# EAGLE design shield (EAGLE 6.4)
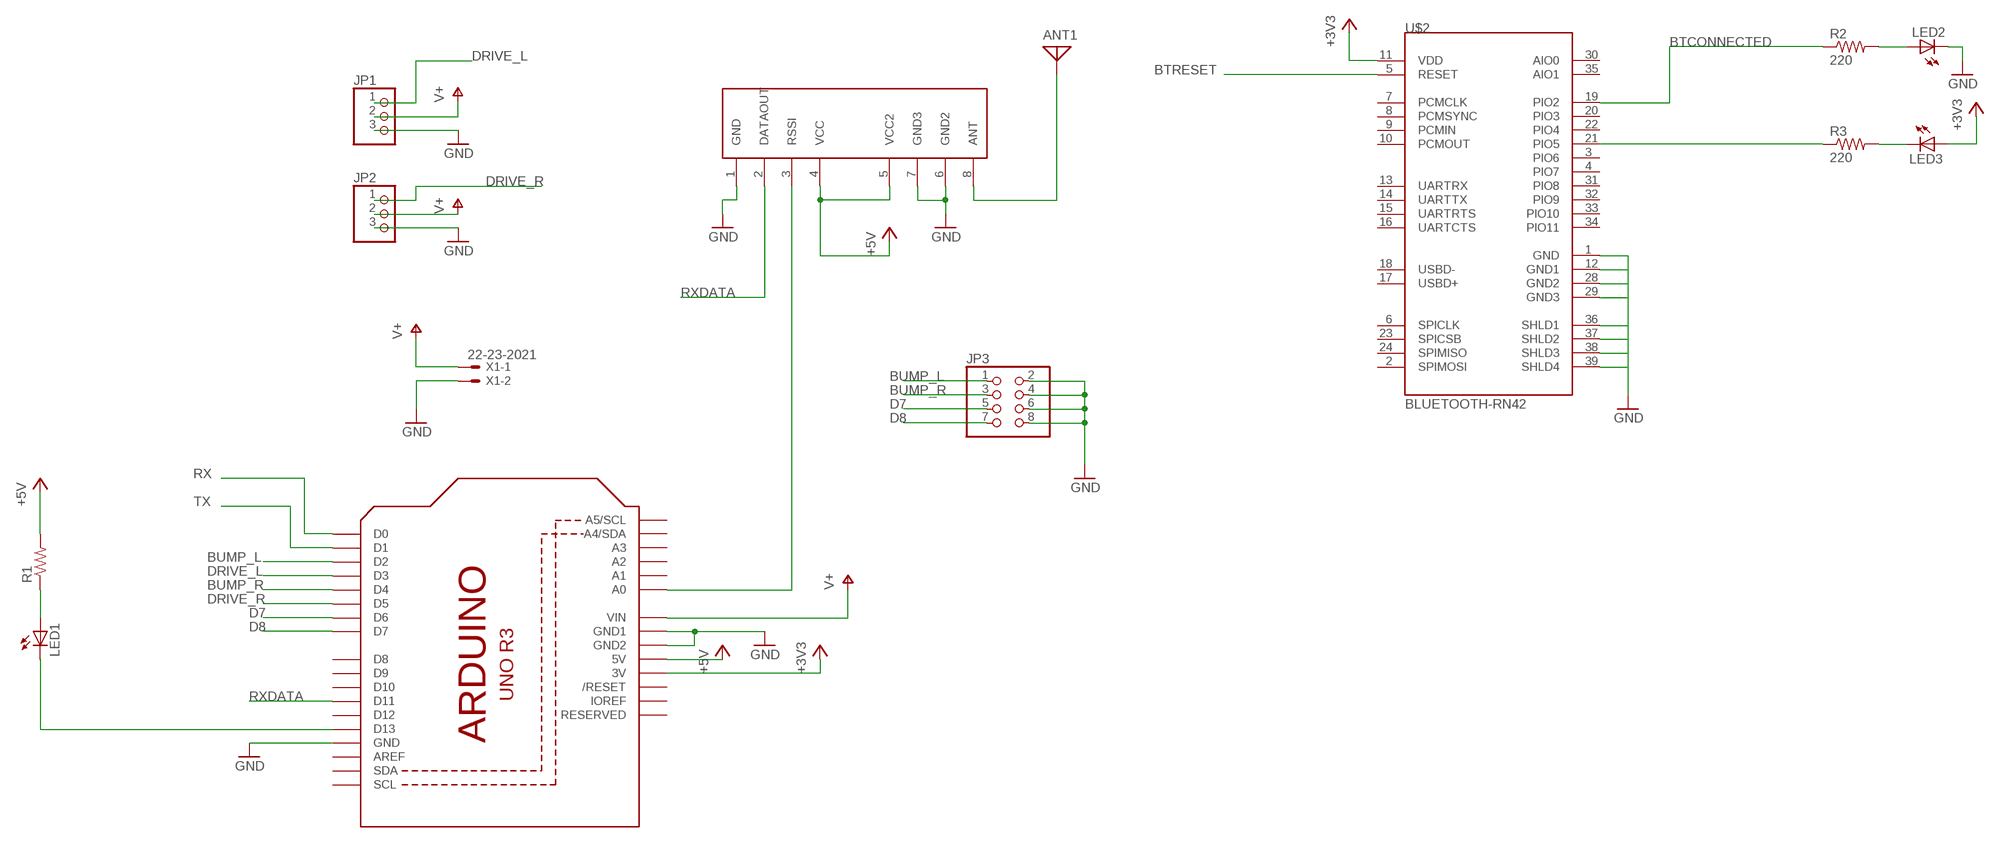
[diagram p0: schematic, sheet 1]

## Parts
ANT1  ANTENNA  [PAD-01]
JP1  PINHD-1X3  [1X03]
JP2  PINHD-1X3  [1X03]
JP3  PINHD-2X4  [2X04]
LED1  LED3MM  [LED3MM]
LED2  LED3MM  [LED3MM]
LED3  LED3MM  [LED3MM]
R1  R-US_R0805  [R0805]
R2  220  R-US_R0805  [R0805]
R3  220  R-US_R0805  [R0805]
U1  ARDUINOR3-DIMENSION  [ARDUINOR3]
U$1  RWS371  [RWS-371]
U$2  BLUETOOTH-RN42  [RN42]
X1  22-23-2021  [22-23-2021]

## Nets
+3V3: LED3.A U1.3V U$2.11(VDD)
+5V: R1.2 U1.5V U$1.4(VCC) U$1.5(VCC2)
BTCONNECTED: R2.1 U$2.19(PIO2)
BTRESET: U$2.5(RESET)
BUMP_L: JP3.1 U1.D2
BUMP_R: JP3.3 U1.D4
D7: JP3.5 U1.D6
D8: JP3.7 U1.D7
DRIVE_L: JP1.1 U1.D3
DRIVE_R: JP2.1 U1.D5
GND: JP1.3 JP2.3 JP3.2 JP3.4 JP3.6 JP3.8 LED2.K(C) U1.GND U1.GND1 U1.GND2 U$1.1(GND) U$1.6(GND2) U$1.7(GND3) U$2.1(GND) U$2.12(GND1) U$2.28(GND2) U$2.29(GND3) U$2.36(SHLD1) U$2.37(SHLD2) U$2.38(SHLD3) U$2.39(SHLD4) X1.2
N$1: U1.A0 U$1.3(RSSI)
N$2: LED1.A R1.1
N$3: LED1.K(C) U1.D13
N$4: ANT1.1 U$1.8(ANT)
N$5: LED2.A R2.2
N$7: LED3.K(C) R3.2
N$8: R3.1 U$2.21(PIO5)
RX: U1.D0
RXDATA: U1.D11 U$1.2(DATAOUT)
TX: U1.D1
V+: JP1.2 JP2.2 U1.VIN X1.1
Unconnected: U1.A1 U1.A2 U1.A3 U1.A4(A4/SDA) U1.A5(A5/SCL) U1.AREF U1.D8 U1.D9 U1.D10 U1.D12 U1.IOREF U1.RESERVED U1.RESET(/RESET) U1.SCL U1.SDA U$2.2(SPIMOSI) U$2.3(PIO6) U$2.4(PIO7) U$2.6(SPICLK) U$2.7(PCMCLK) U$2.8(PCMSYNC) U$2.9(PCMIN) U$2.10(PCMOUT) U$2.13(UARTRX) U$2.14(UARTTX) U$2.15(UARTRTS) U$2.16(UARTCTS) U$2.17(USBD+) U$2.18(USBD-) U$2.20(PIO3) U$2.22(PIO4) U$2.23(SPICSB) U$2.24(SPIMISO) U$2.30(AIO0) U$2.31(PIO8) U$2.32(PIO9) U$2.33(PIO10) U$2.34(PIO11) U$2.35(AIO1)

## Library data of the parts
ANT1 = discrete:ANTENNA: Antenna
JP1 JP2 = adafruit:PINHD-1X3: PIN HEADER
JP3 = adafruit:PINHD-2X4: PIN HEADER
LED1-LED3 = led:LED: LED OSRAM: - CHIPLED LG R971, LG N971, LY N971, LG Q971, LY Q971, LO R971, LY R971 LH N974, LH R974 LS Q976, LO Q976, LY Q976 LO Q996 - Hyper CHIPLED LW Q18S LB Q993, LB Q99A, LB R99A - SideLED LS A670, LO A670, LY A670, LG A670, LP A670 LB A673, LV A673, LT A673, LW A673 LH A674 LY A675 LS A676, LA A676, LO A676, LY A676, LW A676 LS A679, LY A679, LG A679 - Hyper Micro SIDELED® LS Y876, LA Y876, LO Y876, LY Y876 LT Y87S - SmartLED LW L88C, LW L88S LB L89C, LB L89S, LG L890 LS L89K, LO L89K, LY L89K LS L896, LA L896, LO L896, LY L896 - TOPLED LS T670, LO T670, LY T670, LG T670, LP T670 LSG T670, LSP T670, LSY T670, LOP T670, LYG T670 LG T671, LOG T671, LSG T671 LB T673, LV T673, LT T673, LW T673 LH T674 LS T676, LA T676, LO T676, LY T676, LB T676, LH T676, LSB T676, LW T676 LB T67C, LV T67C, LT T67C, LS T67K, LO T67K, LY T67K, LW E67C LS E67B, LA E67B, LO E67B, LY E67B, LB E67C, LV E67C, LT E67C LW T67C LS T679, LY T679, LG T679 LS T770, LO T770, LY T770, LG T770, LP T770 LB T773, LV T773, LT T773, LW T773 LH T774 LS E675, LA E675, LY E675, LS T675 LS T776, LA T776, LO T776, LY T776, LB T776 LHGB T686 LT T68C, LB T68C - Hyper Mini TOPLED® LB M676 - Mini TOPLED Santana® LG M470 LS M47K, LO M47K, LY M47K Source: http://www.osram.convergy.de LUXEON: - LUMILED® LXK2-PW12-R00, LXK2-PW12-S00, LXK2-PW14-U00, LXK2-PW14-V00 LXK2-PM12-R00, LXK2-PM12-S00, LXK2-PM14-U00 LXK2-PE12-Q00, LXK2-PE12-R00, LXK2-PE12-S00, LXK2-PE14-T00, LXK2-PE14-U00 LXK2-PB12-K00, LXK2-PB12-L00, LXK2-PB12-M00, LXK2-PB14-N00, LXK2-PB14-P00, LXK2-PB14-Q00 LXK2-PR12-L00, LXK2-PR12-M00, LXK2-PR14-Q00, LXK2-PR14-R00 LXK2-PD12-Q00, LXK2-PD12-R00, LXK2-PD12-S00 LXK2-PH12-R00, LXK2-PH12-S00 LXK2-PL12-P00, LXK2-PL12-Q00, LXK2-PL12-R00 Source: www.luxeon.com KINGBRIGHT: KA-3528ASYC Source: www.kingbright.com
R1-R3 = resistor:R-US_: RESISTOR, American symbol
U1 = adafruit:ARDUINOR3: This is a new object for the new Arduino R3 - with extra pins that you may want to use (such as IOref, and duplicated A4/A5
U$1 = rkf:RWS371
U$2 = RN4x:BLUETOOTH-RN42
X1 = con-molex:22-23-2021: .100" (2.54mm) Center Header - 2 Pin; MF: MOLEX; MPN: 22-23-2021; OC_FARNELL: 1462926; OC_NEWARK: 25C3832

## Board
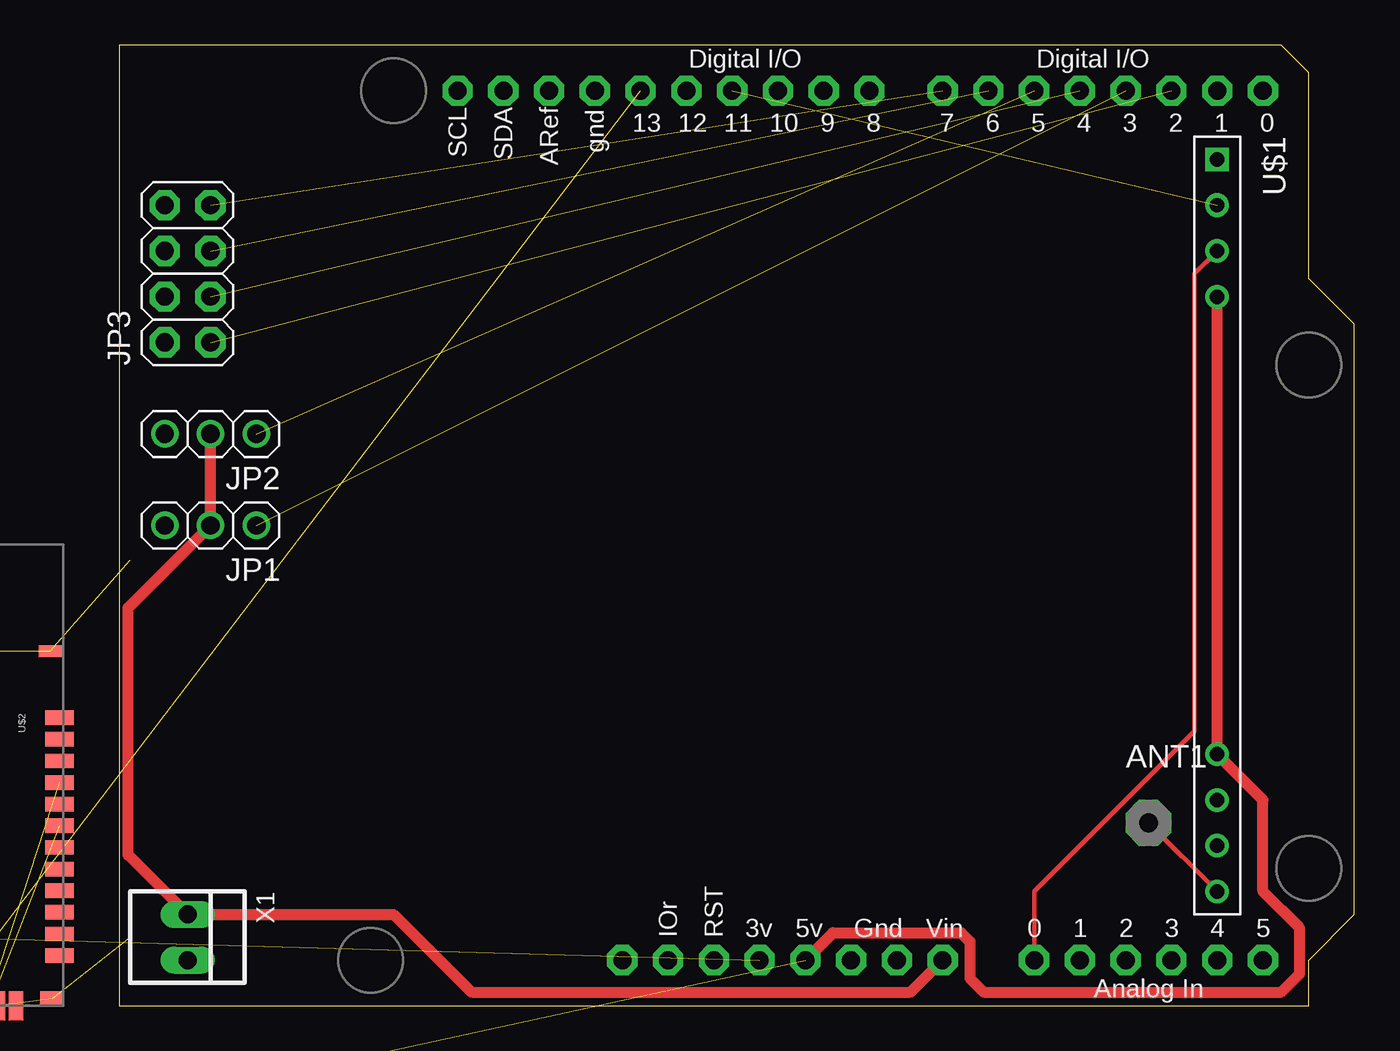
[diagram p1: board, top side]
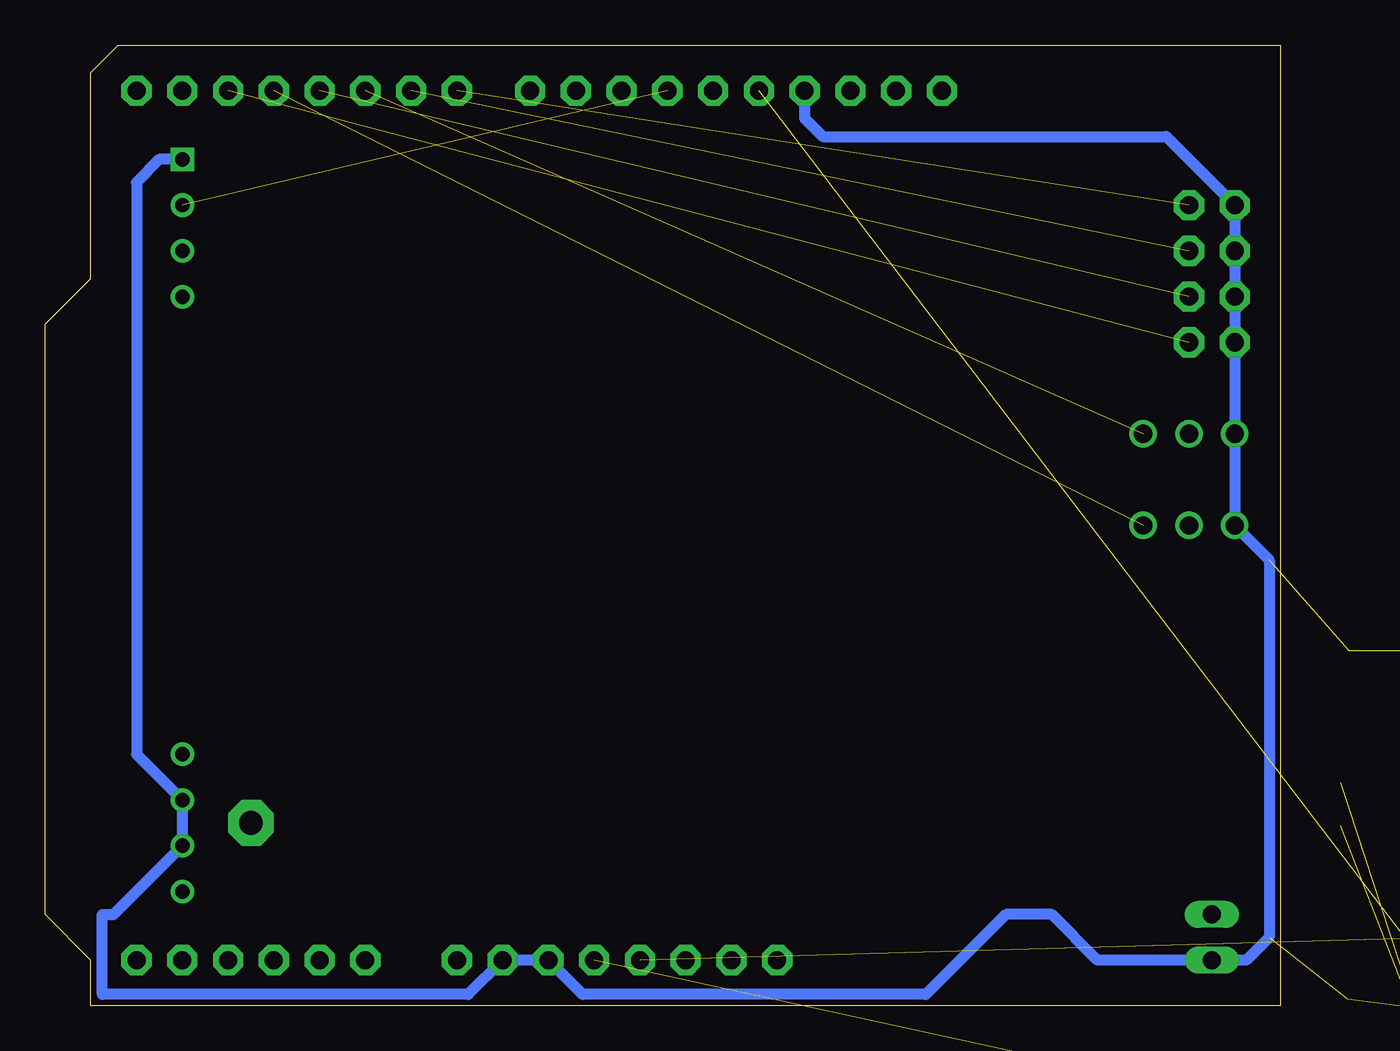
[diagram p2: board, bottom side, seen from below]

Size 68.58 x 53.34 mm. Coordinates in mm from the lower left corner, seen from the top.
Copper layers (1*16): Top 0.035mm / dielectric 1.5mm / Bottom 0.035mm
Design rules "default": minimum track width 10mil, minimum drill 24mil, track to track 8mil, track to pad 8mil, pad to pad 8mil, via to via 8mil, smd to smd 8mil, copper to edge 40mil, drill to drill 8mil, minimum pad ring 10mil, minimum via ring 8mil, stop-mask expansion 4mil, vias tented up to drill 0mil, thermal gap 10mil

### Footprints (pad centres in the part's own frame; a part is rotated, then mirrored left to right if it is on the bottom)
PAD-01 = drill 1.321 pad 2.54 octagon: 1 0,0
1X03 = drill 1.016: 1 -2.54,0; 2 0,0; 3 2.54,0
2X04 = drill 1.016 pad 1.676 octagon: 1 -3.81,-1.27; 2 -3.81,1.27; 3 -1.27,-1.27; 4 -1.27,1.27; 5 1.27,-1.27; 6 1.27,1.27; 7 3.81,-1.27; 8 3.81,1.27
LED3MM = drill 0.813 octagon: A -1.27,0; K 1.27,0
R0805 = smd 1.3 x 1.5: 1 -0.85,0; 2 0.85,0
ARDUINOR3 = drill 1 pad 1.676 octagon: 3V 35.56,2.54; 5V 38.1,2.54; A0 50.8,2.54; A1 53.34,2.54; A2 55.88,2.54; A3 58.42,2.54; A4 60.96,2.54; A5 63.5,2.54; AREF 23.876,50.8; D0 63.5,50.8; D1 60.96,50.8; D2 58.42,50.8; D3 55.88,50.8; D4 53.34,50.8; D5 50.8,50.8; D6 48.26,50.8; D7 45.72,50.8; D8 41.656,50.8; D9 39.116,50.8; D10 36.576,50.8; D11 34.036,50.8; D12 31.496,50.8; D13 28.956,50.8; GND 26.416,50.8; GND1 43.18,2.54; GND2 40.64,2.54; IOREF 30.48,2.54; RESERVED 27.94,2.54; RESET 33.02,2.54; SCL 18.796,50.8; SDA 21.336,50.8; VIN 45.72,2.54
RWS-371 = drill 0.8 square: 1 0,0 | drill 0.8: 2 2.54,0; 3 5.08,0; 4 7.62,0; 5 33.02,0; 6 35.56,0; 7 38.1,0; 8 40.64,0
RN42 = smd 1.6 x 0.8: 1 0.004,15.998; 2 0.004,14.798; 3 0.004,13.598; 4 0.004,12.398; 5 0.004,11.198; 6 0.004,9.998; 7 0.004,8.798; 8 0.004,7.598; 9 0.004,6.398; 10 0.004,5.198; 11 0.004,3.998; 12 0.004,2.798; 13 13.204,2.798; 14 13.204,3.998; 15 13.204,5.198; 16 13.204,6.398; 17 13.204,7.598; 18 13.204,8.798; 19 13.204,9.998; 20 13.204,11.198; 21 13.204,12.398; 22 13.204,13.598; 23 13.204,14.798; 24 13.204,15.998 | smd 0.8 x 1.6: 28 9.8,-0.002; 30 10.8,-0.002; 31 8.504,-0.002; 32 7.304,-0.002; 33 6.1,-0.002; 34 4.9,-0.002 | smd 0.7 x 1.6: 29 3.6,0; 35 2.7,0 | smd 1.3 x 0.8: 36 12.8,0.4 | smd 1.27 x 0.635: 37 12.7,19.7; 38 0.6,19.7; 39 0.6,0.3
22-23-2021 = drill 1 long: 1 -1.27,0; 2 1.27,0

### Placement (x,y rotation side)
ANT1  57.15,10.16 0 top
JP1  5.08,26.67 180 top
JP2  5.08,31.75 180 top
JP3  3.81,40.64 90 top
LED1  -13.97,-3.81 0 top  (outside the outline)
LED2  -13.97,-12.7 0 top  (outside the outline)
LED3  -13.97,-17.78 0 top  (outside the outline)
R1  -15.24,-8.89 0 top  (outside the outline)
R2  -15.24,-22.86 0 top  (outside the outline)
R3  -15.24,-26.67 0 top  (outside the outline)
U1  0,0 0 top
U$1  60.96,46.99 270 top
U$2  -16.51,0 0 top  (outside the outline)
X1  3.81,3.81 270 top

### Tracks (layer width: path | path; a pad name or v marks a point on that pad's centre or on a via)
+3V3  (2 unrouted)
+5V  (1 unrouted)
  Top 0.61: U1.5V 39.62,4.06 46.74,4.06 47.24,3.56 47.24,1.52 48.01,0.76 64.52,0.76 65.53,1.78 65.53,4.32 63.5,6.35 63.5,11.43 U$1.5 U$1.4
BTCONNECTED  (1 unrouted)
BUMP_L  (1 unrouted)
BUMP_R  (1 unrouted)
D7  (1 unrouted)
D8  (1 unrouted)
DRIVE_L  (1 unrouted)
DRIVE_R  (1 unrouted)
GND  (9 unrouted)
  Bottom 0.61: U1.GND 26.42,49.28 25.4,48.26 6.35,48.26 JP3.8 JP3.6 JP3.4 JP3.2 JP2.3 JP1.3 0.64,24.77 0.64,3.81 1.91,2.54 X1.2 10.16,2.54 12.7,5.08 15.24,5.08 19.68,0.64 38.73,0.64 U1.GND2 U1.GND1 45.09,0.64 65.41,0.64 65.41,5.08 64.77,5.08 U$1.7 U$1.6 63.5,13.97 63.5,45.72 62.23,46.99 U$1.1
N$1
  Top 0.254: U$1.3 59.69,40.64 59.69,15.24 50.8,6.35 U1.A0
N$2  (1 unrouted)
N$3  (1 unrouted)
N$4
  Top 0.254: ANT1.1 U$1.8
N$5  (1 unrouted)
N$7  (1 unrouted)
N$8  (1 unrouted)
RXDATA  (1 unrouted)
V+
  Top 0.61: U1.VIN 43.94,0.76 19.56,0.76 15.24,5.08 X1.1 0.51,8.38 0.51,22.1 JP1.2 JP2.2